# Altium schematic sheet pca20054_sheet2_block_diagram.SchDoc: PCA20054 - Block Diagram
size A3; Organization: Nordic Semiconductor; DocumentNumber: 1; Revision: 1.0.0; SheetNumber: 2; SheetTotal: 5; Date: 2020-02-07; CompanyName: Nordic Semiconductor; DrawnBy: KJP; ProjectNumber: 4467
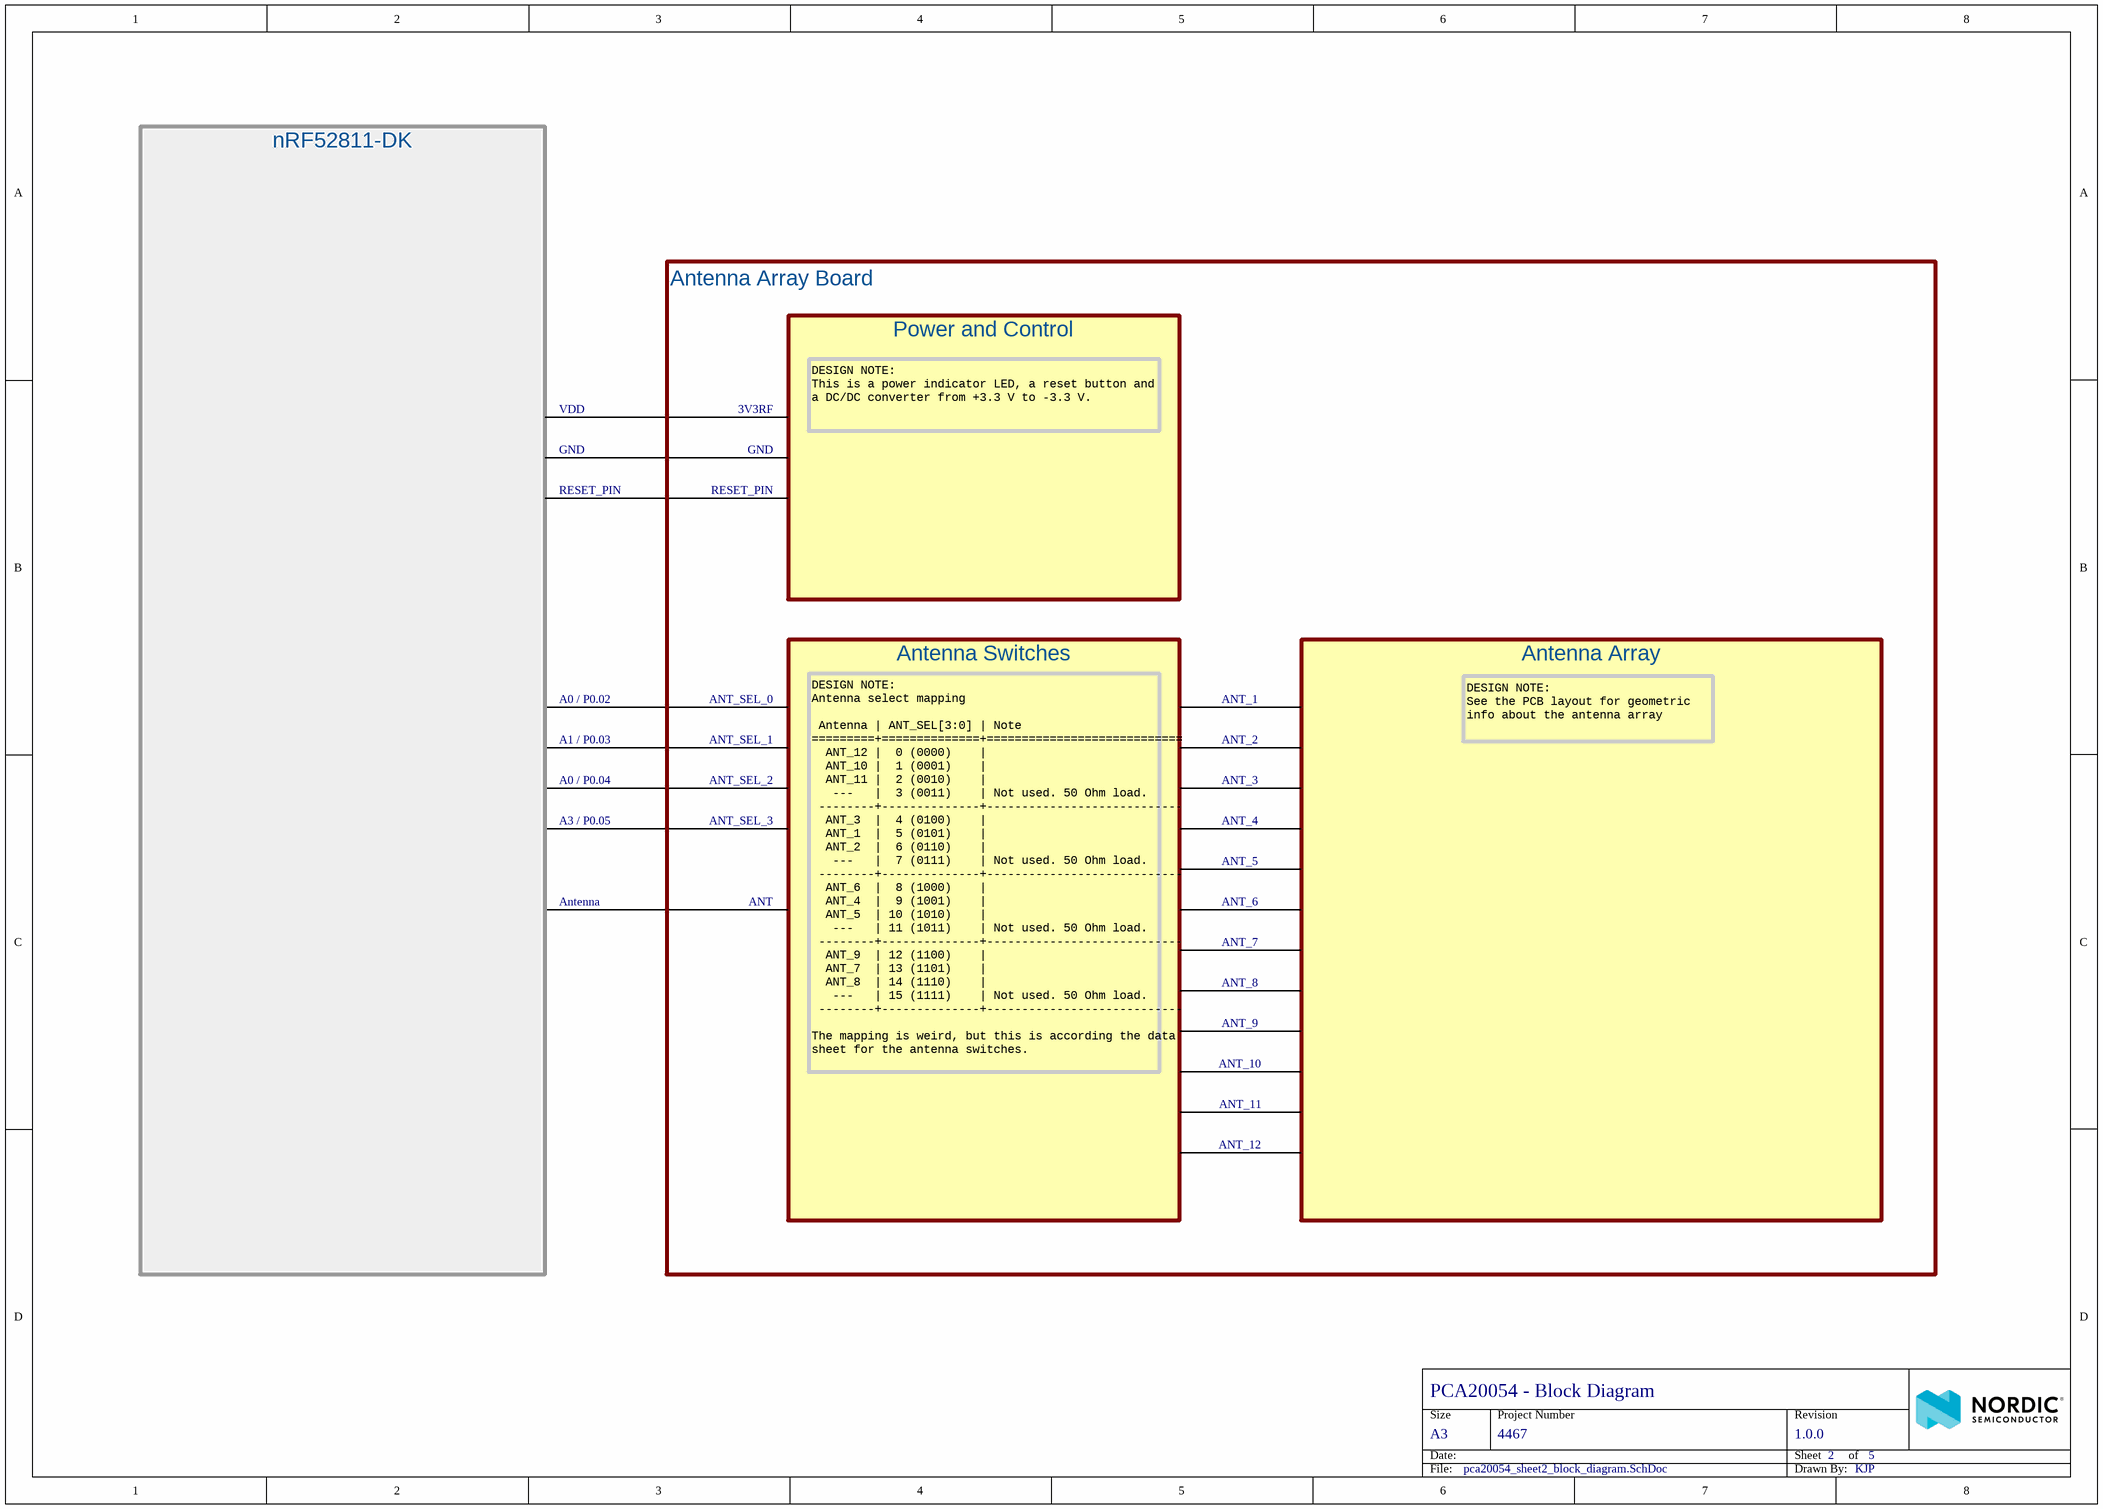
[diagram p0: pca20054_sheet2_block_diagram.SchDoc]

## Notes on the sheet
- GND
- VDD
- 3V3RF
- DESIGN NOTE:
  This is a power indicator LED, a reset button and a DC/DC converter from +3.3 V to -3.3 V.
- RESET_PIN
- Power and Control
- A0 / P0.02
- ANT_SEL_0
- ANT_1
- A0 / P0.04
- A1 / P0.03
- ANT_SEL_2
- ANT_SEL_1
- ANT_3
- ANT_2
- DESIGN NOTE:
  See the PCB layout for geometric info about the antenna array
- A3 / P0.05
- ANT_SEL_3
- ANT_4
- Antenna
- ANT
- ANT_6
- ANT_5
- ANT_8
- ANT_7
- ANT_9
- DESIGN NOTE:
  Antenna select mapping
  Antenna | ANT_SEL[3:0] | Note
  =========+==============+============================
  ANT_12 |  0 (0000)    |
  ANT_10 |  1 (0001)    |
  ANT_11 |  2 (0010)    |
  ---   |  3 (0011)    | Not used. 50 Ohm load.
  --------+--------------+----------------------------
  ANT_3  |  4 (0100)    |
  ANT_1  |  5 (0101)    |
  ANT_2  |  6 (0110)    |
  ---   |  7 (0111)    | Not used. 50 Ohm load.
  --------+--------------+----------------------------
  ANT_6  |  8 (1000)    |
  ANT_4  |  9 (1001)    |
  ANT_5  | 10 (1010)    |
  ---   | 11 (1011)    | Not used. 50 Ohm load.
  --------+--------------+----------------------------
  ANT_9  | 12 (1100)    |
  ANT_7  | 13 (1101)    |
  ANT_8  | 14 (1110)    |
  ---   | 15 (1111)    | Not used. 50 Ohm load.
  --------+--------------+----------------------------
  The mapping is weird, but this is according the data
  sheet for the antenna switches.
- ANT_11
- ANT_10
- ANT_12
- Antenna Switches
- Antenna Array
- nRF52811-DK
- Antenna Array Board
- Size
- Date:
- A3
- Project Number
- Sheet         of
- Revision
- File:
- Drawn By: